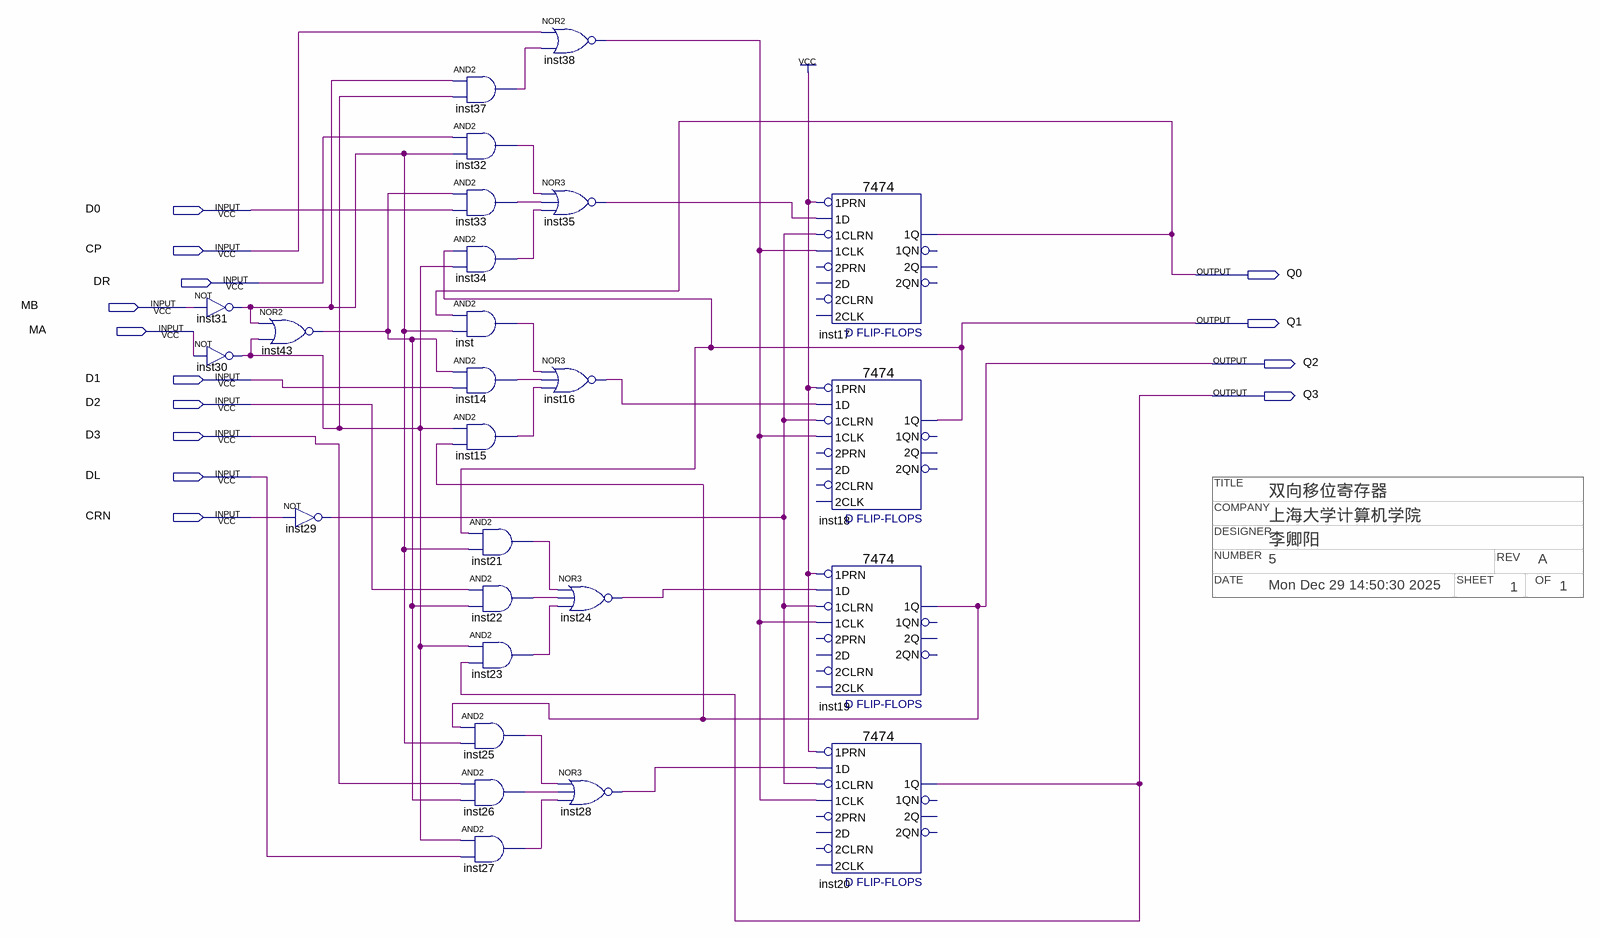
[diagram p0: schematic sheet]
// Quartus schematic sikao2.bdf as structural Verilog: 26 symbols, 14 pins
// Title block: TITLE: 双向移位寄存器; COMPANY: 上海大学计算机学院; DESIGNER: 李卿阳; NUMBER: 5; REV: A; DATE: Mon Dec 29 14:50:30 2025; SHEET: 1; OF: 1
module sikao2 (
  input  D0,
  input  CP,
  input  DR,
  input  MB,
  input  MA,
  input  D1,
  input  D2,
  input  D3,
  input  DL,
  input  CRN,
  output Q0,
  output Q1,
  output Q2,
  output Q3
);

  wire inst14_out, inst15_out, inst16_out, inst21_out, inst22_out, inst23_out, inst24_out, inst25_out,
       inst26_out, inst27_out, inst28_out, inst29_out, inst30_out, inst31_out, inst32_out, inst33_out,
       inst34_out, inst35_out, inst37_out, inst38_out, inst43_out, inst_out;

  not inst31 (inst31_out, MB);
  not inst30 (inst30_out, MA);
  nor inst43 (inst43_out, inst31_out, inst30_out);
  not inst29 (inst29_out, CRN);
  and inst37 (inst37_out, inst31_out, inst30_out);
  and inst32 (inst32_out, DR, inst31_out);
  and inst33 (inst33_out, inst43_out, D0);
  and inst34 (inst34_out, Q1, inst30_out);
  and inst (inst_out, Q0, inst31_out);
  and inst14 (inst14_out, inst43_out, D1);
  and inst15 (inst15_out, inst30_out, Q2);
  and inst21 (inst21_out, Q1, inst31_out);
  and inst22 (inst22_out, D2, inst43_out);
  and inst23 (inst23_out, inst30_out, Q3);
  and inst25 (inst25_out, Q2, inst31_out);
  and inst26 (inst26_out, D3, inst43_out);
  and inst27 (inst27_out, inst30_out, DL);
  nor inst38 (inst38_out, CP, inst37_out);
  nor inst35 (inst35_out, inst32_out, inst33_out, inst34_out);
  nor inst16 (inst16_out, inst_out, inst14_out, inst15_out);
  nor inst24 (inst24_out, inst21_out, inst22_out, inst23_out);
  nor inst28 (inst28_out, inst25_out, inst26_out, inst27_out);
  \7474  inst17 (
    .\1CLK (inst38_out), .\1D (inst35_out), .\1PRN (1'b1), .\1CLRN (inst29_out), .\1Q (Q0));  // open: 2D, 2PRN, 2CLK, 2CLRN, 1QN, 2Q, 2QN
  \7474  inst18 (
    .\1CLK (inst38_out), .\1D (inst16_out), .\1PRN (1'b1), .\1CLRN (inst29_out), .\1Q (Q1));  // open: 2D, 2PRN, 2CLK, 2CLRN, 1QN, 2Q, 2QN
  \7474  inst19 (
    .\1CLK (inst38_out), .\1D (inst24_out), .\1PRN (1'b1), .\1CLRN (inst29_out), .\1Q (Q2));  // open: 2D, 2PRN, 2CLK, 2CLRN, 1QN, 2Q, 2QN
  \7474  inst20 (
    .\1CLK (inst38_out), .\1D (inst28_out), .\1PRN (1'b1), .\1CLRN (inst29_out), .\1Q (Q3));  // open: 2D, 2PRN, 2CLK, 2CLRN, 1QN, 2Q, 2QN
endmodule
